# EAGLE schematic tiny-dev (EAGLE 5.11)
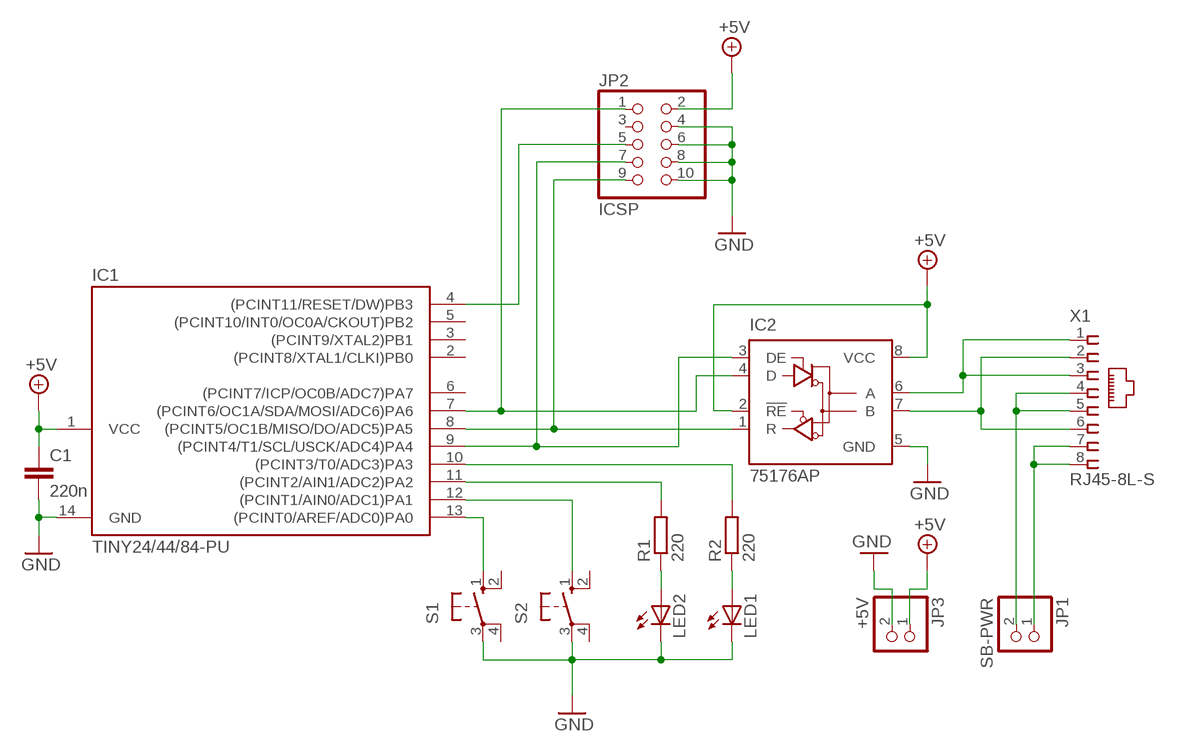
[diagram p0: schematic, sheet 1]

## Parts
C1  220n  C-EU025-024X044  [C025-024X044]
IC1  TINY24/44/84-PU  [DIL14]
IC2  75176AP  [DIL08]
JP1  SB-PWR  PINHD-1X2  [1X02]
JP2  ICSP  PINHD-2X5  [2X05]
JP3  +5V  PINHD-1X2  [1X02]
LED1  LED3MM  [LED3MM]
LED2  LED3MM  [LED3MM]
R1  220  R-EU_0207/10  [0207/10]
R2  220  R-EU_0207/10  [0207/10]
S1  10-XX  [B3F-10XX]
S2  10-XX  [B3F-10XX]
X1  RJ45-8L-S  [RJ45-NO-SHIELD]

## Nets
+5V: C1.1 IC1.1(VCC) IC2.2(!RE) IC2.8(VCC) JP2.2 JP3.1
GND: C1.2 IC1.14(GND) IC2.5(GND) JP2.4 JP2.6 JP2.8 JP2.10 JP3.2 LED1.K(C) LED2.K(C) S1.3(P) S2.3(P)
N$1: IC1.8((PCINT5/OC1B/MISO/DO/ADC5)PA5) IC2.1(R) JP2.9
N$2: IC1.9((PCINT4/T1/SCL/USCK/ADC4)PA4) IC2.3(DE) JP2.7
N$3: IC1.4((PCINT11/RESET/DW)PB3) JP2.5
N$4: IC1.13((PCINT0/AREF/ADC0)PA0) S1.1(S)
N$5: IC1.12((PCINT1/AIN0/ADC1)PA1) S2.1(S)
N$6: IC1.7((PCINT6/OC1A/SDA/MOSI/ADC6)PA6) IC2.4(D) JP2.1
N$7: IC1.11((PCINT2/AIN1/ADC2)PA2) R1.2
N$8: IC1.10((PCINT3/T0/ADC3)PA3) R2.2
N$9: LED2.A R1.1
N$10: LED1.A R2.1
N$11: IC2.6(A) X1.1 X1.3
N$12: IC2.7(B) X1.2 X1.6
N$13: JP1.2 X1.4 X1.5
N$14: JP1.1 X1.7 X1.8
Unconnected: IC1.2((PCINT8/XTAL1/CLKI)PB0) IC1.3((PCINT9/XTAL2)PB1) IC1.5((PCINT10/INT0/OC0A/CKOUT)PB2) IC1.6((PCINT7/ICP/OC0B/ADC7)PA7) JP2.3 S1.2(S1) S1.4(P1) S2.2(S1) S2.4(P1)

## Library data of the parts
C1 = rcl:C-EU: CAPACITOR, European symbol
IC1 = avr-6:TINY24/44/84
IC2 = 751xx:75176A: DIFFERENTIAL BUS TRANSCEIVER Source: http://focus.ti.com/lit/ds/symlink/sn75176a.pdf
JP1 JP3 = pinhead:PINHD-1X2: PIN HEADER
JP2 = pinhead:PINHD-2X5: PIN HEADER
LED1 LED2 = led:LED: LED OSRAM: - CHIPLED LG R971, LG N971, LY N971, LG Q971, LY Q971, LO R971, LY R971 LH N974, LH R974 LS Q976, LO Q976, LY Q976 LO Q996 - Hyper CHIPLED LW Q18S LB Q993, LB Q99A, LB R99A - SideLED LS A670, LO A670, LY A670, LG A670, LP A670 LB A673, LV A673, LT A673, LW A673 LH A674 LY A675 LS A676, LA A676, LO A676, LY A676, LW A676 LS A679, LY A679, LG A679 - Hyper Micro SIDELED® LS Y876, LA Y876, LO Y876, LY Y876 LT Y87S - SmartLED LW L88C, LW L88S LB L89C, LB L89S, LG L890 LS L89K, LO L89K, LY L89K LS L896, LA L896, LO L896, LY L896 - TOPLED LS T670, LO T670, LY T670, LG T670, LP T670 LSG T670, LSP T670, LSY T670, LOP T670, LYG T670 LG T671, LOG T671, LSG T671 LB T673, LV T673, LT T673, LW T673 LH T674 LS T676, LA T676, LO T676, LY T676, LB T676, LH T676, LSB T676, LW T676 LB T67C, LV T67C, LT T67C, LS T67K, LO T67K, LY T67K, LW E67C LS E67B, LA E67B, LO E67B, LY E67B, LB E67C, LV E67C, LT E67C LW T67C LS T679, LY T679, LG T679 LS T770, LO T770, LY T770, LG T770, LP T770 LB T773, LV T773, LT T773, LW T773 LH T774 LS E675, LA E675, LY E675, LS T675 LS T776, LA T776, LO T776, LY T776, LB T776 LHGB T686 LT T68C, LB T68C - Hyper Mini TOPLED® LB M676 - Mini TOPLED Santana® LG M470 LS M47K, LO M47K, LY M47K Source: http://www.osram.convergy.de LUXEON: - LUMILED® LXK2-PW12-R00, LXK2-PW12-S00, LXK2-PW14-U00, LXK2-PW14-V00 LXK2-PM12-R00, LXK2-PM12-S00, LXK2-PM14-U00 LXK2-PE12-Q00, LXK2-PE12-R00, LXK2-PE12-S00, LXK2-PE14-T00, LXK2-PE14-U00 LXK2-PB12-K00, LXK2-PB12-L00, LXK2-PB12-M00, LXK2-PB14-N00, LXK2-PB14-P00, LXK2-PB14-Q00 LXK2-PR12-L00, LXK2-PR12-M00, LXK2-PR14-Q00, LXK2-PR14-R00 LXK2-PD12-Q00, LXK2-PD12-R00, LXK2-PD12-S00 LXK2-PH12-R00, LXK2-PH12-S00 LXK2-PL12-P00, LXK2-PL12-Q00, LXK2-PL12-R00 Source: www.luxeon.com KINGBRIGHT: KA-3528ASYC Source: www.kingbright.com
R1 R2 = rcl:R-EU_: RESISTOR, European symbol
S1 S2 = switch-omron:10-XX: OMRON SWITCH; MPN: B3F-1000; OC_FARNELL: 176432; OC_NEWARK: 36M3542
X1 = con-tycoelectronics:RJ45: CORCOM Modular RJ Jacks No Shield Source: www.tycoelectronics.com .. ENG_DS_1654001_1099_RJ_L_0507.pdf; MF: TYCO ELECTRONICS; MPN: RJ45-8L-S; OC_FARNELL: unknown; OC_NEWARK: 80K9067